# EAGLE design taurus_v1 (EAGLE 7.6.0)
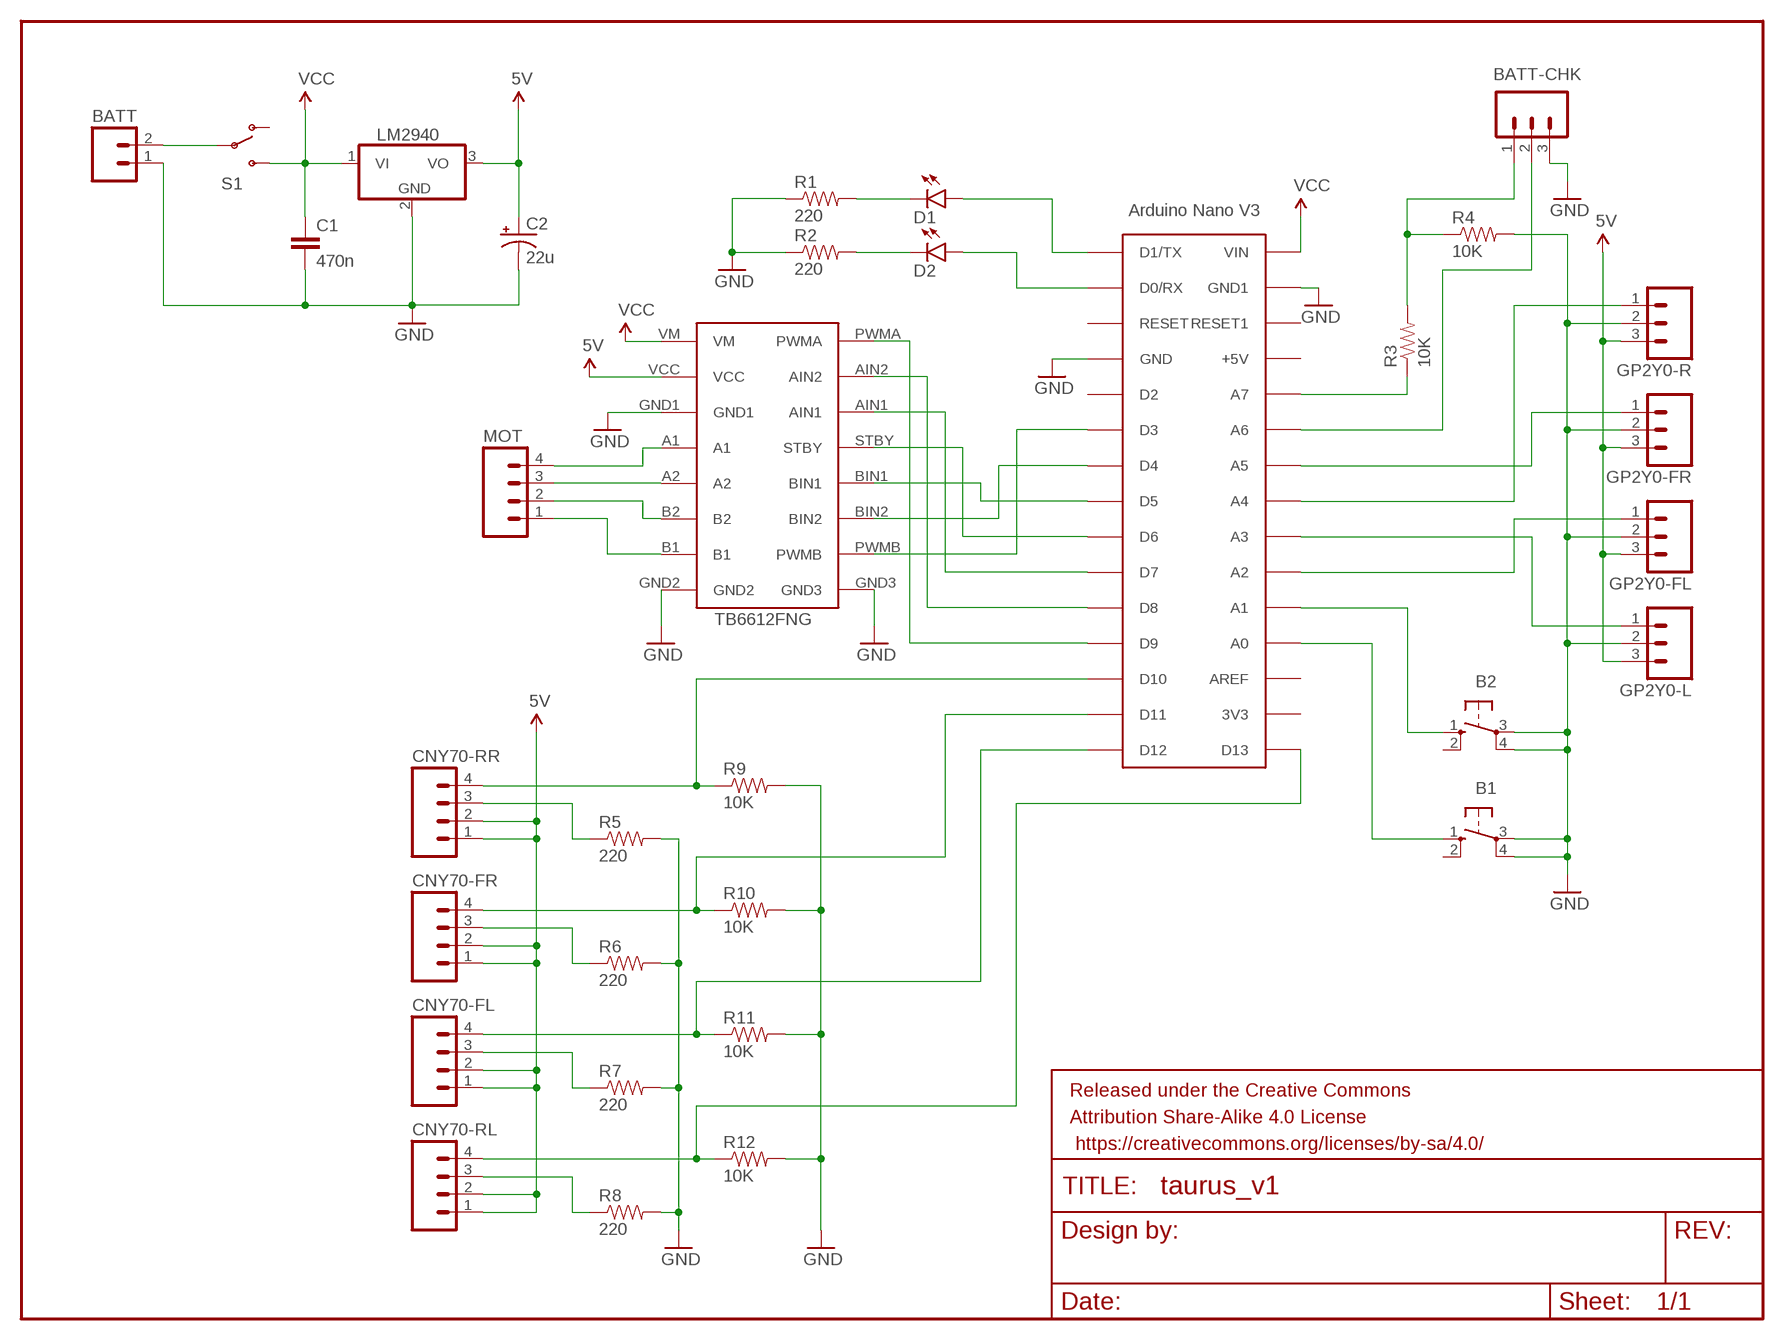
[diagram p0: schematic, sheet 1]

## Parts
B1  10-XX  [B3F-10XX]
B2  10-XX  [B3F-10XX]
BATT  M02PTH  [1X02]
BATT-CHK  M03PTH  [1X03]
C1  470n  CAPPTH1  [CAP-PTH-5MM]
C2  22u  CAP_POLPTH2  [CPOL-RADIAL-10UF-25V]
CNY70-FL  M04PTH  [1X04]
CNY70-FR  M04PTH  [1X04]
CNY70-RL  M04PTH  [1X04]
CNY70-RR  M04PTH  [1X04]
D1  LED3MM  [LED3MM]
D2  LED3MM  [LED3MM]
FRAME1  FRAME-LETTERNO_PACKAGE  [DUMMY]
GP2Y0-FL  M03PTH  [1X03]
GP2Y0-FR  M03PTH  [1X03]
GP2Y0-L  M03PTH  [1X03]
GP2Y0-R  M03PTH  [1X03]
LM2940  7805TV  [TO220V]
MOT  M04PTH  [1X04]
R1  220  RESISTORPTH-1/4W  [AXIAL-0.4]
R2  220  RESISTORPTH-1/4W  [AXIAL-0.4]
R3  10K  RESISTORPTH-1/4W  [AXIAL-0.4]
R4  10K  RESISTORPTH-1/4W  [AXIAL-0.4]
R5  220  RESISTORPTH-1/4W  [AXIAL-0.4]
R6  220  RESISTORPTH-1/4W  [AXIAL-0.4]
R7  220  RESISTORPTH-1/4W  [AXIAL-0.4]
R8  220  RESISTORPTH-1/4W  [AXIAL-0.4]
R9  10K  RESISTORPTH-1/4W  [AXIAL-0.4]
R10  10K  RESISTORPTH-1/4W  [AXIAL-0.4]
R11  10K  RESISTORPTH-1/4W  [AXIAL-0.4]
R12  10K  RESISTORPTH-1/4W  [AXIAL-0.4]
S1  SWITCH-SPDTPTH  [SWITCH-SPDT]
TB1  TB6612FNG  [TB6612FNG]
U$1  ARDUINONANO  [PDIP-32]

## Nets
5V [supply]: C2.1(+) CNY70-FL.1 CNY70-FL.2 CNY70-FR.1 CNY70-FR.2 CNY70-RL.1 CNY70-RL.2 CNY70-RR.1 CNY70-RR.2 GP2Y0-FL.3 GP2Y0-FR.3 GP2Y0-L.3 GP2Y0-R.3 LM2940.3(VO) TB1.VCC
GND [supply]: B1.3(P) B1.4(P1) B2.3(P) B2.4(P1) BATT-CHK.3 BATT.1 C1.2 C2.2(-) GP2Y0-FL.2 GP2Y0-FR.2 GP2Y0-L.2 GP2Y0-R.2 LM2940.2(GND) R1.P$1 R2.P$1 R4.P$2 R5.P$2 R6.P$2 R7.P$2 R8.P$2 R9.P$2 R10.P$2 R11.P$2 R12.P$2 TB1.GND1 TB1.GND2 TB1.GND3 U$1.GND U$1.GND1
N$1: TB1.PWMA U$1.D9
N$2: TB1.AIN2 U$1.D8
N$3: TB1.AIN1 U$1.D7
N$4: TB1.STBY U$1.D6
N$5: TB1.BIN1 U$1.D5
N$6: TB1.BIN2 U$1.D4
N$7: TB1.PWMB U$1.D3
N$8: D1.K(C) R1.P$2
N$9: D2.K(C) R2.P$2
N$10: D2.A U$1.D0/RX
N$11: D1.A U$1.D1/TX
N$12 [supply]: BATT.2 S1.2(P)
N$13: B1.1(S) U$1.A7(A0)
N$14: B2.1(S) U$1.A6(A1)
N$15: GP2Y0-L.1 U$1.A4(A3)
N$16: GP2Y0-R.1 U$1.A3(A4)
N$17: GP2Y0-FL.1 U$1.A5(A2)
N$19 [supply]: BATT-CHK.2 U$1.A1(A6)
N$20: R3.P$1 U$1.A0(A7)
N$21 [supply]: BATT-CHK.1 R3.P$2 R4.P$1
N$22 [motor]: MOT.4 TB1.A1
N$23 [motor]: MOT.3 TB1.A2
N$24 [motor]: MOT.2 TB1.B2
N$25 [motor]: MOT.1 TB1.B1
N$26: CNY70-RR.4 R9.P$1 U$1.D10
N$27: CNY70-RR.3 R5.P$1
N$28: CNY70-FR.3 R6.P$1
N$29: CNY70-FL.3 R7.P$1
N$30: CNY70-RL.3 R8.P$1
N$31: CNY70-FR.4 R10.P$1 U$1.D11
N$32: CNY70-RL.4 R12.P$1 U$1.D13
N$33: CNY70-FL.4 R11.P$1 U$1.D12
N$35: GP2Y0-FR.1 U$1.A2(A5)
VCC [supply]: C1.1 LM2940.1(VI) S1.3(S) TB1.VM U$1.VIN
Unconnected: B1.2(S1) B2.2(S1) S1.1(O) U$1.3V3 U$1.+5V U$1.AREF U$1.D2 U$1.RESET U$1.RESET1

## Library data of the parts
B1 B2 = switch-omron:10-XX: OMRON SWITCH; MPN: B3F-1000; OC_FARNELL: 176432; OC_NEWARK: 36M3542
BATT = SparkFun-Connectors:M02: Standard 2-pin 0.1" header. Use with - straight break away headers ( PRT-00116) - right angle break away headers (PRT-00553) - swiss pins (PRT-00743) - machine pins (PRT-00117) - female headers (PRT-00115) Molex polarized connector foot print use with: PRT-08233 with associated crimp pins and housings. 2.54_SCREWTERM for use with PRT-10571. 3.5mm Screw Terminal footprints for PRT-08084 5mm Screw Terminal footprints for use with PRT-08432
BATT-CHK GP2Y0-FL GP2Y0-FR GP2Y0-L GP2Y0-R = SparkFun-Connectors:M03: Header 3 Standard 3-pin 0.1" header. Use with straight break away headers (SKU : PRT-00116), right angle break away headers (PRT-00553), swiss pins (PRT-00743), machine pins (PRT-00117), and female headers (PRT-00115). Molex polarized connector foot print use with SKU : PRT-08232 with associated crimp pins and housings.
C1 = SparkFun-Capacitors:CAP: Capacitor Standard 0603 ceramic capacitor, and 0.1" leaded capacitor.
C2 = SparkFun-Capacitors:CAP_POL: Capacitor Polarized These are standard SMD and PTH capacitors. Normally 10uF, 47uF, and 100uF in electrolytic and tantalum varieties. Always verify the external diameter of the through hole cap, it varies with capacity, voltage, and manufacturer. The EIA devices should be standard.
CNY70-FL CNY70-FR CNY70-RL CNY70-RR MOT = SparkFun-Connectors:M04: Header 4 Standard 4-pin 0.1" header. Use with straight break away headers (SKU : PRT-00116), right angle break away headers (PRT-00553), swiss pins (PRT-00743), machine pins (PRT-00117), and female headers (PRT-00115). Molex polarized connector foot print use with SKU : PRT-08231 with associated crimp pins and housings. 1MM SMD Version SKU: PRT-10208; PROD_ID: CONN-09696
D1 D2 = SparkFun-LED:LED: LEDs Standard schematic elements and footprints for 5mm, 3mm, 1206, and 0603 sized LEDs. 5mm - Spark Fun Electronics SKU : COM-00529 (and others); PROD_ID: DIO-08794
FRAME1 = SparkFun-Aesthetics:FRAME-LETTER: Schematic Frame Standard 8.5x11 US Letter frame; DESIGNER: Nobody; VERSION: v01
LM2940 = linear:78*: Positive VOLTAGE REGULATOR Source: http://cache.national.com/ds/LM/LM78L05.pdf http://www.fairchildsemi.com/ds/LM/LM7805.pdf
R1-R12 = SparkFun-Passives:RESISTOR: Resistor Basic schematic elements and footprints for 0603, 1206, and PTH resistors.
S1 = SparkFun-Electromechanical:SWITCH-SPDT: SPDT Switch Simple slide switch, Spark Fun Electronics SKU : COM-00102 DPDT SMT slide switch, AYZ0202, SWCH-08179; PROD_ID: SWCH-08261
TB1 = TB6612FNG:TB6612FNG
U$1 = CRE-Lib1:ARDUINONANO: Arduino Nano

## Net classes
0 default: width 0.254 mm
1 supply: width 0.508 mm
2 motor: width 0.508 mm

## Board
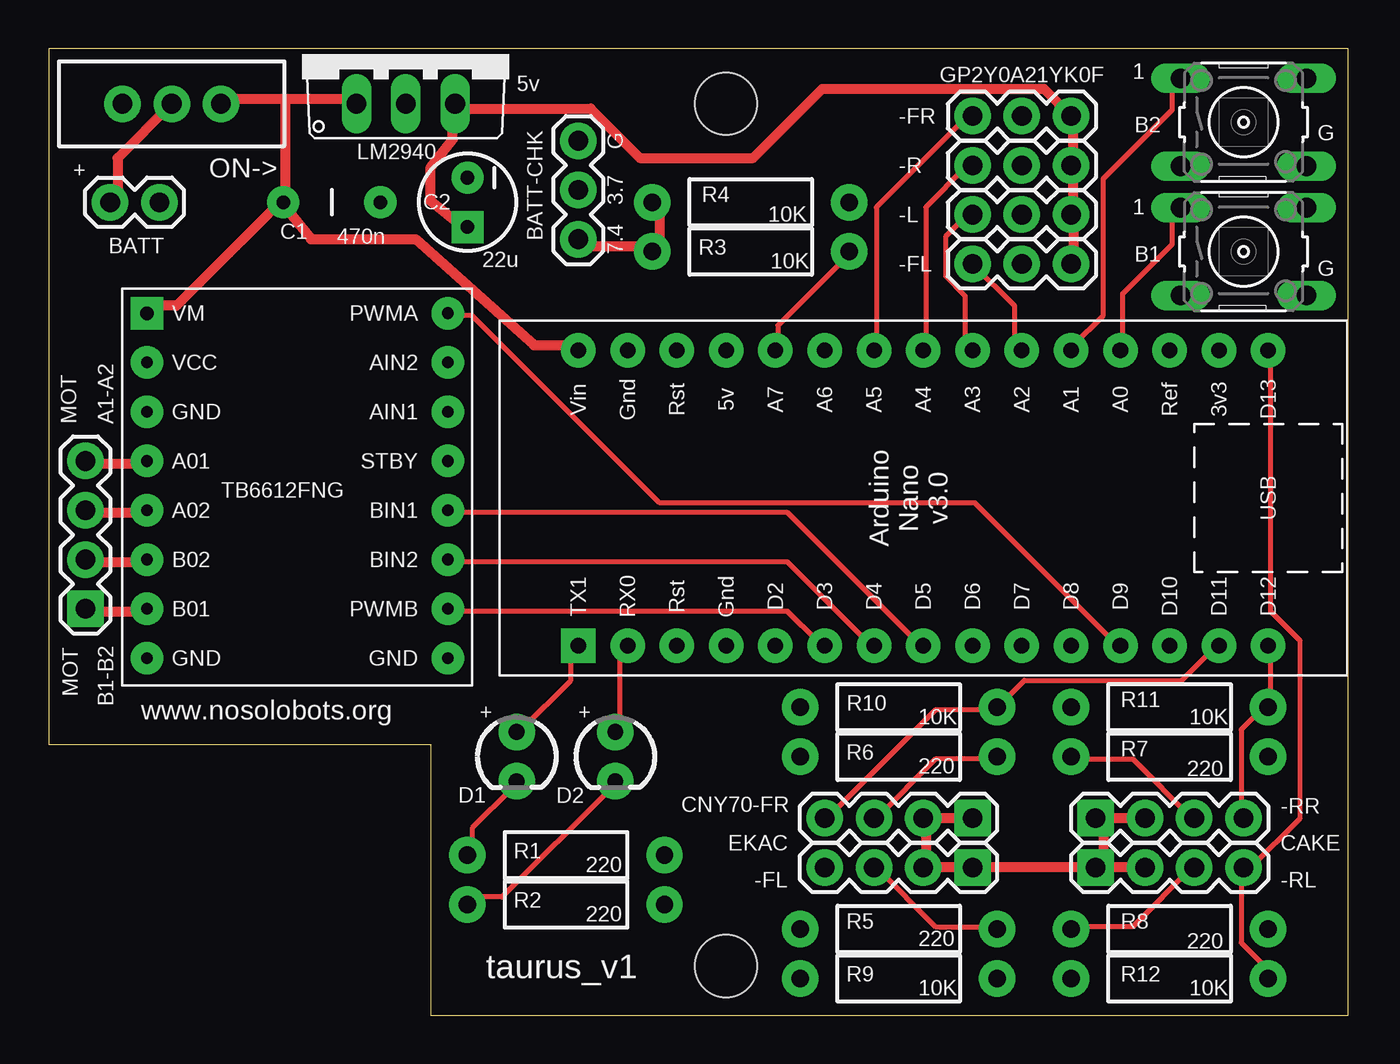
[diagram p1: board, top side]
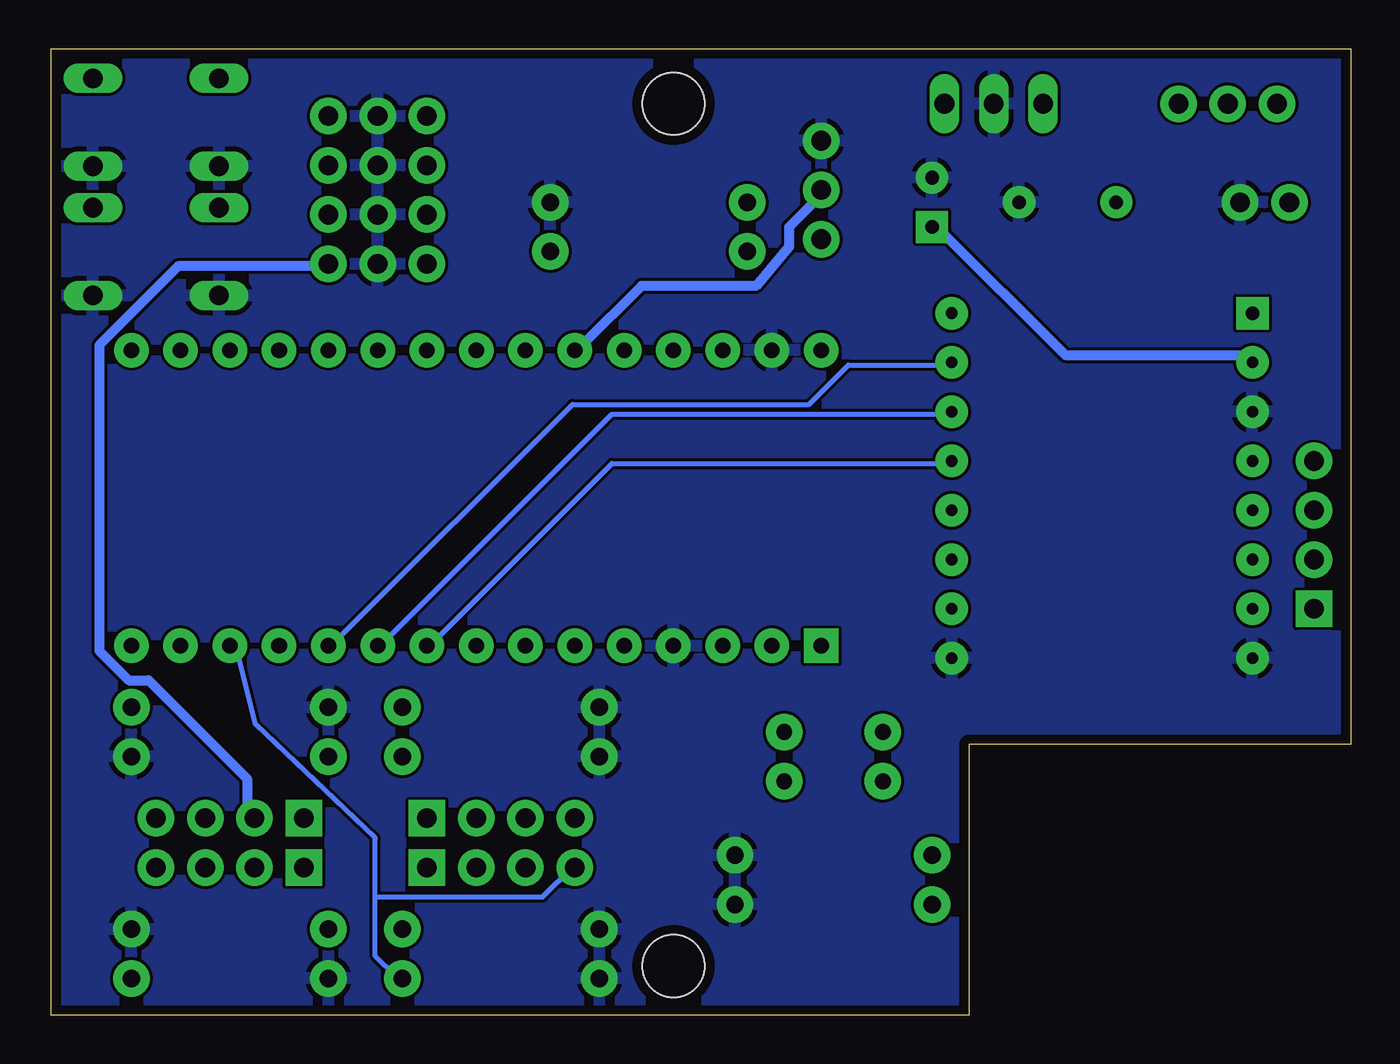
[diagram p2: board, bottom side, seen from below]

Size 66.98 x 49.84 mm. Coordinates in mm from the lower left corner, seen from the top.
Outline: 0,13.97 19.68,13.97 19.68,0 66.98,0 66.98,49.84 0,49.84 0,13.97
Copper layers (1*16): Top 0.035mm / dielectric 1.6mm / Bottom 0.035mm
Design rules "Elecrow_2-layer_PCB_eagle_rule": minimum track width 6mil, minimum drill 12mil, track to track 6mil, track to pad 6mil, pad to pad 6mil, via to via 8mil, smd to smd 0mil, copper to edge 20mil, drill to drill 10mil, minimum pad ring 6mil, minimum via ring 6mil, stop-mask expansion 0mil, vias tented up to drill 100mil, thermal gap 10mil
Holes 3.2 mm at 34.92,46.99 34.92,2.54

### Footprints (pad centres in the part's own frame; a part is rotated, then mirrored left to right if it is on the bottom)
B3F-10XX = drill 1.016 long: 1 -3.251,2.261; 2 3.251,2.261; 3 -3.251,-2.261; 4 3.251,-2.261
1X02 = drill 1.016 pad 1.88: 1 0,0; 2 2.54,0
1X03 = drill 1.016 pad 1.88: 1 0,0; 2 2.54,0; 3 5.08,0
CAP-PTH-5MM = drill 0.7 pad 1.651: 1 -2.5,0; 2 2.5,0
CPOL-RADIAL-10UF-25V = drill 0.7 pad 1.651 square: 1 1.27,0 | drill 0.7 pad 1.651: 2 -1.27,0
1X04 = drill 1.016 pad 1.88 square: 1 0,0 | drill 1.016 pad 1.88: 2 2.54,0; 3 5.08,0; 4 7.62,0
LED3MM = drill 0.813 pad 1.88: A -1.27,0; K 1.27,0
TO220V = drill 1.016 long: 1 -2.54,-2.54; 2 0,-2.54; 3 2.54,-2.54
AXIAL-0.4 = drill 0.9 pad 1.88: P$1 -5.08,0; P$2 5.08,0
SWITCH-SPDT = drill 1.016 pad 1.88: 1 0,2.54; 2 0,0; 3 0,-2.54
TB6612FNG = drill 0.6 pad 1.676: A1 -7.62,-1.27; A2 -7.62,-3.81; AIN1 7.874,1.27; AIN2 7.874,3.81; B1 -7.62,-8.89; B2 -7.62,-6.35; BIN1 7.874,-3.81; BIN2 7.874,-6.35; GND1 -7.62,1.27; GND2 -7.62,-11.43; GND3 7.874,-11.43; PWMA 7.874,6.35; PWMB 7.874,-8.89; STBY 7.874,-1.27; VCC -7.62,3.81 | drill 0.7 pad 1.676 square: VM -7.62,6.35
PDIP-32 = drill 0.8 pad 1.778: 3V3 15.24,-35.56; +5V 15.24,-10.16; A0 15.24,-12.7; A1 15.24,-15.24; A2 15.24,-17.78; A3 15.24,-20.32; A4 15.24,-22.86; A5 15.24,-25.4; A6 15.24,-27.94; A7 15.24,-30.48; AREF 15.24,-33.02; D0/RX 0,-5.08; D2 0,-12.7; D3 0,-15.24; D4 0,-17.78; D5 0,-20.32; D6 0,-22.86; D7 0,-25.4; D8 0,-27.94; D9 0,-30.48; D10 0,-33.02; D11 0,-35.56; D12 0,-38.1; D13 15.24,-38.1; GND 0,-10.16; GND1 15.24,-5.08; RESET 0,-7.62; RESET1 15.24,-7.62; VIN 15.24,-2.54 | drill 0.8 pad 1.778 square: D1/TX 0,-2.54

### Placement (x,y rotation side)
B1  61.59,39.37 0 top
B2  61.59,46.04 0 top
BATT  5.71,41.91 180 top
BATT-CHK  27.3,40.01 90 top
C1  14.61,41.91 0 top
C2  21.59,41.91 270 top
CNY70-FL  53.98,10.16 0 top
CNY70-FR  47.62,10.16 180 top
CNY70-RL  53.98,7.62 0 top
CNY70-RR  47.62,7.62 180 top
D1  24.13,13.34 270 top
D2  29.21,13.34 270 top
FRAME1  -0.3,-0.3 0 top
GP2Y0-FL  47.62,38.73 0 top
GP2Y0-FR  47.62,46.35 0 top
GP2Y0-L  47.62,41.27 0 top
GP2Y0-R  47.62,43.81 0 top
LM2940  18.41,49.53 0 top
MOT  1.91,20.95 90 top
R1  26.67,8.26 180 top
R2  26.67,5.71 180 top
R3  36.2,39.37 180 top
R4  36.2,41.91 0 top
R5  43.81,4.45 180 top
R6  43.81,13.34 180 top
R7  57.78,13.34 0 top
R8  57.78,4.45 0 top
R9  43.81,1.91 180 top
R10  43.81,15.88 180 top
R11  57.78,15.88 180 top
R12  57.78,1.91 180 top
S1  6.35,46.99 90 top
TB1  12.7,29.84 0 top
U$1  24.77,19.05 90 top

### Tracks (layer width: path | path; a pad name or v marks a point on that pad's centre or on a via)
5V
  Top 0.508: 45.21,7.62 CNY70-RR.1 CNY70-RL.1 54.36,7.62 | CNY70-FR.1 45.21,10.16 | 45.21,10.16 45.21,7.62 | 45.21,7.62 CNY70-RR.2 | 45.21,10.16 CNY70-FR.2 | CNY70-RL.2 54.36,7.62 | CNY70-FL.2 54.36,10.16 | 54.36,10.16 54.36,7.62 | 54.36,10.16 CNY70-FL.1 | GP2Y0-FL.3 52.83,39.12 52.83,41.15 GP2Y0-L.3 52.83,41.66 52.83,43.69 GP2Y0-R.3 52.83,44.2 52.83,46.23 GP2Y0-FR.3 51.31,47.75 39.88,47.75 36.32,44.2 30.48,44.2 27.94,46.74 21.34,46.74 LM2940.3 20.83,46.74 20.83,45.15 19.68,43.69 19.68,41.97 21.34,40.64 C2.1
  Bottom 0.508: TB1.VCC 5.08,34.04 14.73,34.04 21.34,40.64 C2.1 | CNY70-FL.2 56.9,10.16 56.9,12.19 61.98,17.27 62.99,17.27 64.52,18.8 64.52,34.54 60.45,38.61 52.83,38.61 GP2Y0-FL.3
GND
  pour Bottom: 0,13.97 19.68,13.97 19.68,0 66.67,0 66.67,49.53 0,49.53
N$1
  Top 0.254: TB1.PWMA 20.83,36.07 21.84,36.07 31.5,26.42 47.75,26.42 54.86,19.3 U$1.D9
N$2
  Bottom 0.254: TB1.AIN2 20.83,33.53 25.91,33.53 27.94,31.5 40.13,31.5 52.32,19.3 U$1.D8
N$3
  Bottom 0.254: TB1.AIN1 20.83,30.99 38.1,30.99 49.78,19.3 U$1.D7
N$4
  Bottom 0.254: TB1.STBY 20.83,28.45 38.1,28.45 47.24,19.3 U$1.D6
N$5
  Top 0.254: TB1.BIN1 20.83,25.91 38.1,25.91 44.7,19.3 U$1.D5
N$6
  Top 0.254: TB1.BIN2 20.83,23.37 38.1,23.37 42.16,19.3 U$1.D4
N$7
  Top 0.254: TB1.PWMB 20.83,20.83 38.1,20.83 39.62,19.3 U$1.D3
N$8
  Top 0.254: R1.P$2 21.84,8.64 21.84,9.65 23.88,11.68 D1.K
N$9
  Top 0.254: R2.P$2 21.84,6.1 23.37,6.1 28.96,11.68 D2.K
N$10
  Top 0.254: U$1.D0/RX 29.46,18.8 29.46,14.73 D2.A
N$11
  Top 0.254: U$1.D1/TX 26.92,18.8 26.92,17.27 24.38,14.73 D1.A
N$12
  Top 0.508: S1.2 3.56,44.2 3.56,42.16 BATT.2
N$13
  Top 0.254: B1.1 57.91,41.15 57.91,39.75 55.37,37.21 55.37,34.54 U$1.A7
N$14
  Top 0.254: B2.1 57.91,48.26 57.91,46.67 54.36,43.12 54.36,36.07 52.83,34.54 U$1.A6
N$15
  Top 0.254: U$1.A4 47.24,34.54 47.24,37.08 46.23,38.1 46.23,40.13 47.24,41.15 GP2Y0-L.1
N$16
  Top 0.254: U$1.A3 45.21,34.54 45.21,41.66 47.24,43.69 GP2Y0-R.1
N$17
  Top 0.254: GP2Y0-FL.1 49.78,36.58 49.78,34.54 U$1.A5
N$19
  Bottom 0.508: U$1.A1 39.62,34.54 36.58,37.59 30.67,37.59 28.96,39.62 28.96,40.64 27.43,42.16 BATT-CHK.2
N$20
  Top 0.254: U$1.A0 37.59,34.54 37.59,35.56 41.15,39.12 R3.P$1
N$21
  Top 0.508: R4.P$1 31.5,41.66 31.5,39.62 R3.P$2 30.99,39.62 27.43,39.62 BATT-CHK.1
N$22
  Top 0.508: TB1.A1 5.08,28.45 2.03,28.45 MOT.4
N$23
  Top 0.508: TB1.A2 5.08,25.91 2.03,25.91 MOT.3
N$24
  Top 0.508: TB1.B2 5.08,23.37 2.03,23.37 MOT.2
N$25
  Top 0.508: TB1.B1 5.08,20.83 2.03,20.83 MOT.1
N$26
  Bottom 0.254: 50.29,6.1 50.29,3.05 49.28,2.03 R9.P$1 | 50.29,6.1 50.29,9.14 56.45,14.99 57.4,18.8 U$1.D10 | 50.29,6.1 41.66,6.1 40.13,7.62 CNY70-RR.4
N$27
  Top 0.254: R5.P$1 48.77,4.57 45.72,4.57 42.67,7.62 CNY70-RR.3
N$28
  Top 0.254: CNY70-FR.3 42.67,10.16 45.72,13.21 48.77,13.21 R6.P$1
N$29
  Top 0.254: CNY70-FL.3 58.93,10.16 55.88,13.21 52.83,13.21 R7.P$1
N$30
  Top 0.254: R8.P$1 52.83,4.57 55.88,4.57 58.93,7.62 CNY70-RL.3
N$31
  Top 0.254: U$1.D11 59.94,18.8 58.42,17.27 50.29,17.27 R10.P$1 48.77,15.75 45.72,15.75 40.13,10.16 CNY70-FR.4
N$32
  Top 0.254: U$1.D13 62.99,34.04 62.99,20.83 64.52,19.3 64.52,10.16 61.98,7.62 CNY70-RL.4 61.47,7.62 61.47,3.75 62.48,2.73 62.48,2.03 R12.P$1
N$33
  Top 0.254: U$1.D12 62.99,18.8 62.99,16.26 R11.P$1 62.48,15.75 61.47,14.73 61.47,10.16 CNY70-FL.4
N$35
  Top 0.254: U$1.A2 42.67,34.54 42.67,41.66 47.24,46.23 GP2Y0-FR.1
VCC
  Top 0.508: 12.19,47.24 9.14,47.24 S1.3 | 12.19,47.24 15.75,47.24 LM2940.1 | 12.19,47.24 12.19,42.16 C1.1 | TB1.VM 5.08,36.58 6.6,36.58 11.68,41.66 C1.1 | U$1.VIN 26.92,34.54 25.02,34.54 18.92,40.01 13.53,40.01 12.19,41.66 C1.1

### Text on the board
tPlace: GP2Y0A21YK0F | 5v | 1 | -FR | G | G | -R | + | ON-> | 3.7 | -L | 1 | 7.4 | -FL | G | MOT | A1-A2 | B1-B2 | www.nosolobots.org | + | + | -RR | EKAC | CAKE | -FL | -RL | taurus_v1